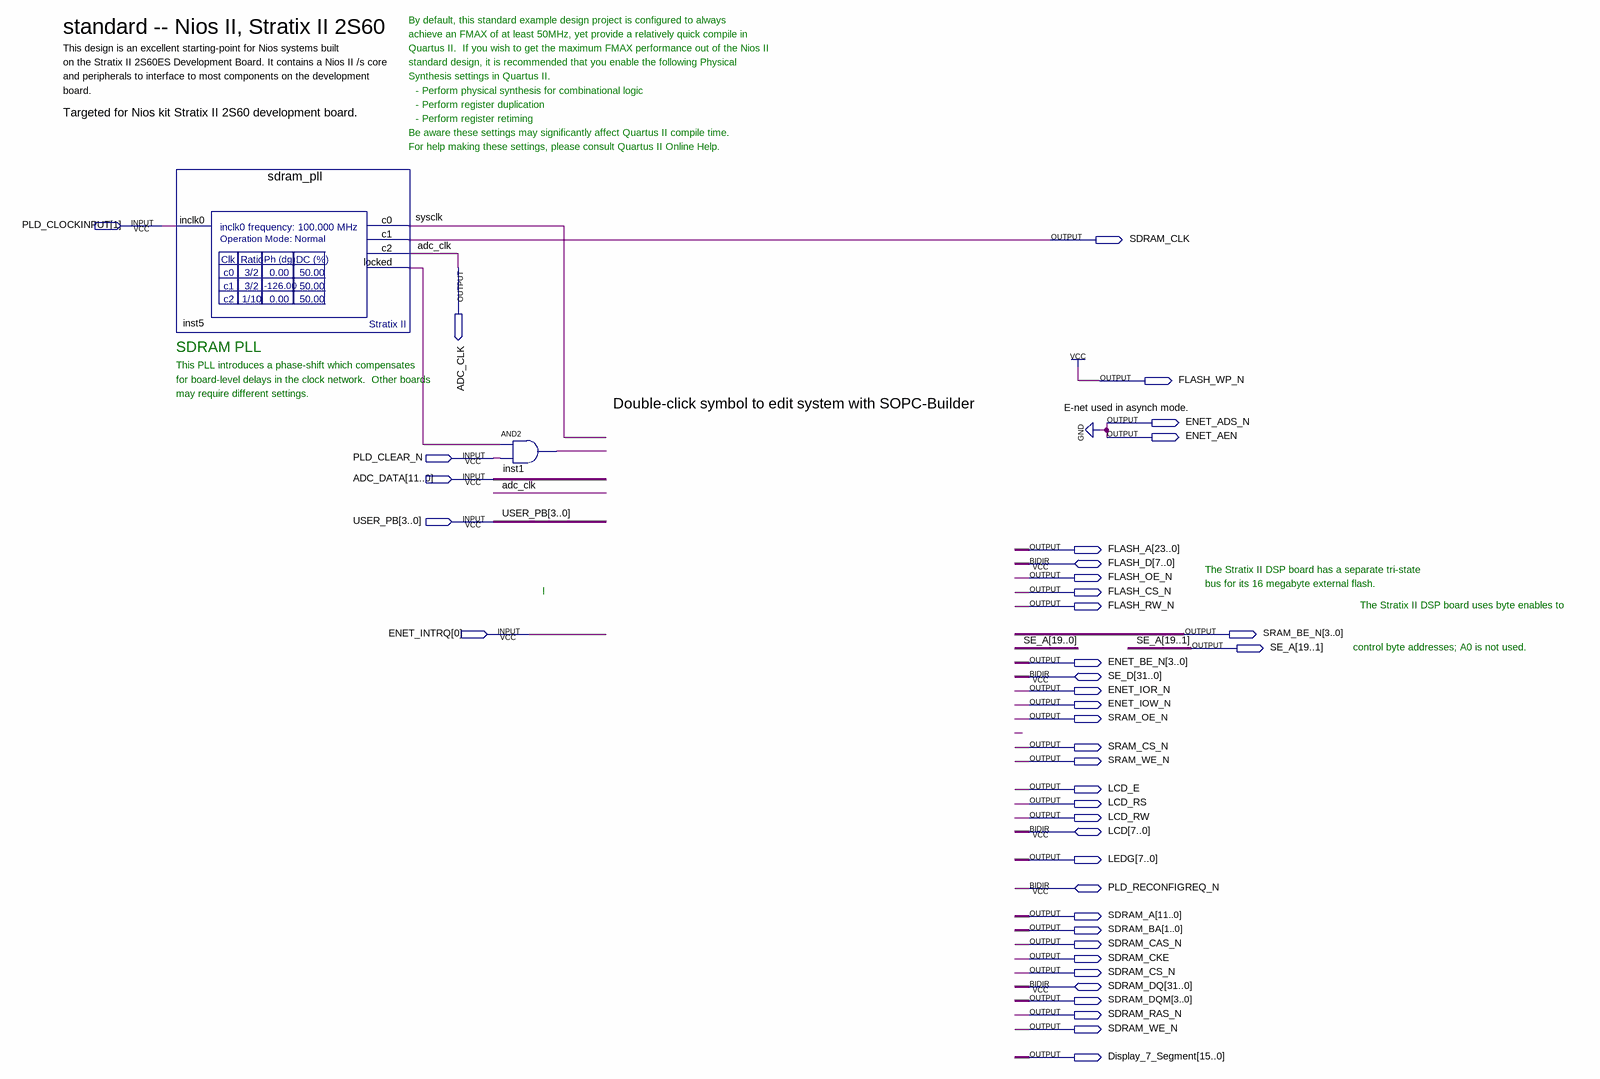
[diagram p0: schematic sheet]
// Quartus schematic standard0.bdf as structural Verilog: 2 symbols, 40 pins
module standard0 (
  input  [1:1] PLD_CLOCKINPUT,
  input  PLD_CLEAR_N,
  input  [11:0] ADC_DATA,
  input  [3:0] USER_PB,
  input  [0:0] ENET_INTRQ,
  inout  [7:0] FLASH_D,
  inout  [31:0] SE_D,
  inout  [7:0] LCD,
  inout  PLD_RECONFIGREQ_N,
  inout  [31:0] SDRAM_DQ,
  output SDRAM_CLK,
  output ADC_CLK,
  output FLASH_WP_N,
  output ENET_ADS_N,
  output ENET_AEN,
  output [23:0] FLASH_A,
  output FLASH_OE_N,
  output FLASH_CS_N,
  output FLASH_RW_N,
  output [3:0] SRAM_BE_N,
  output [19:1] SE_A,
  output [3:0] ENET_BE_N,
  output ENET_IOR_N,
  output ENET_IOW_N,
  output SRAM_OE_N,
  output SRAM_CS_N,
  output SRAM_WE_N,
  output LCD_E,
  output LCD_RS,
  output LCD_RW,
  output [7:0] LEDG,
  output [11:0] SDRAM_A,
  output [1:0] SDRAM_BA,
  output SDRAM_CAS_N,
  output SDRAM_CKE,
  output SDRAM_CS_N,
  output [3:0] SDRAM_DQM,
  output SDRAM_RAS_N,
  output SDRAM_WE_N,
  output [15:0] Display_7_Segment
);

  wire inst1_out, inst5_locked, sysclk;

  sdram_pll inst5 (.inclk0(PLD_CLOCKINPUT[1]), .c0(sysclk), .c1(SDRAM_CLK), .c2(ADC_CLK), .locked(inst5_locked));
  and inst1 (inst1_out, inst5_locked, PLD_CLEAR_N);

  assign ENET_ADS_N = 1'b0;
  assign ENET_AEN = 1'b0;
  assign FLASH_WP_N = 1'b1;

  // Notes on the sheet:
  //   standard -- Nios II, Stratix II 2S60
  //   By default, this standard example design project is configured to always
  //   achieve an FMAX of at least 50MHz, yet provide a relatively quick compile in
  //   This design is an excellent starting-point for Nios systems built
  //   Quartus II.  If you wish to get the maximum FMAX performance out of the Nios II
  //   on the Stratix II 2S60ES Development Board. It contains a Nios II /s core
  //   standard design, it is recommended that you enable the following Physical
  //   and peripherals to interface to most components on the development
  //   Synthesis settings in Quartus II.
  //   board.
  //   - Perform physical synthesis for combinational logic
  //   - Perform register duplication
  //   Targeted for Nios kit Stratix II 2S60 development board.
  //   - Perform register retiming
  //   Be aware these settings may significantly affect Quartus II compile time.
  //   For help making these settings, please consult Quartus II Online Help.
  //   SDRAM PLL
  //   This PLL introduces a phase-shift which compensates
  //   for board-level delays in the clock network.  Other boards
  //   may require different settings.
  //   Double-click symbol to edit system with SOPC-Builder
  //   E-net used in asynch mode.
  //   The Stratix II DSP board has a separate tri-state
  //   bus for its 16 megabyte external flash.
  //   l
  //   The Stratix II DSP board uses byte enables to
  //   control byte addresses; A0 is not used.
endmodule
